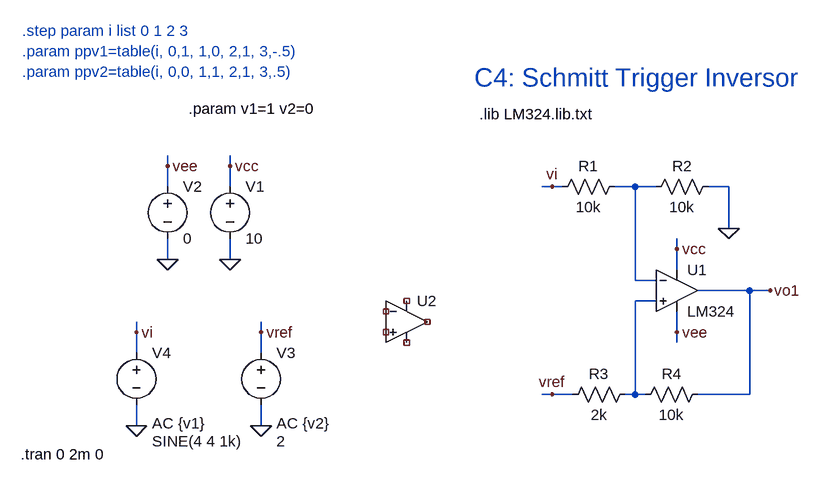
[diagram p0: schematic c4SchmittTriggerInv.asc]
c4SchmittTriggerInv.asc, the LTspice schematic file:
Version 4
SHEET 1 3476 680
WIRE -416 -224 -416 -240
WIRE -320 -224 -320 -240
WIRE -416 -192 -416 -224
WIRE -320 -192 -320 -224
WIRE 176 -192 160 -192
WIRE 192 -192 176 -192
WIRE 304 -192 272 -192
WIRE 336 -192 304 -192
WIRE 448 -192 416 -192
WIRE 448 -128 448 -192
WIRE 368 -96 368 -112
WIRE -416 -80 -416 -112
WIRE -320 -80 -320 -112
WIRE 368 -64 368 -96
WIRE 304 -48 304 -192
WIRE 336 -48 304 -48
WIRE 480 -32 400 -32
WIRE 512 -32 480 -32
WIRE 336 -16 304 -16
WIRE -464 32 -464 16
WIRE -272 32 -272 16
WIRE 368 32 368 0
WIRE 368 48 368 32
WIRE -464 64 -464 32
WIRE -272 64 -272 32
WIRE 176 128 160 128
WIRE 208 128 176 128
WIRE 304 128 304 -16
WIRE 304 128 288 128
WIRE 320 128 304 128
WIRE 480 128 480 -32
WIRE 480 128 400 128
WIRE -464 176 -464 144
WIRE -272 176 -272 144
FLAG -320 -80 0
FLAG -320 -224 vcc
FLAG -416 -80 0
FLAG -416 -224 vee
FLAG -272 176 0
FLAG -272 32 vref
FLAG -464 176 0
FLAG -464 32 vi
FLAG 368 32 vee
FLAG 368 -96 vcc
FLAG 512 -32 vo1
FLAG 176 128 vref
FLAG 448 -128 0
FLAG 176 -192 vi
SYMBOL voltage -320 -208 R0
WINDOW 123 0 0 Left 0
WINDOW 39 0 0 Left 0
SYMATTR InstName V1
SYMATTR Value 10
SYMBOL voltage -416 -208 R0
WINDOW 123 0 0 Left 0
WINDOW 39 0 0 Left 0
SYMATTR InstName V2
SYMATTR Value 0
SYMBOL voltage -272 48 R0
WINDOW 123 24 124 Left 2
WINDOW 39 0 0 Left 0
WINDOW 3 24 152 Left 2
SYMATTR Value2 AC {v2}
SYMATTR Value 2
SYMATTR InstName V3
SYMBOL voltage -464 48 R0
WINDOW 123 24 124 Left 2
WINDOW 39 0 0 Left 0
WINDOW 3 24 152 Left 2
SYMATTR Value2 AC {v1}
SYMATTR Value SINE(4 4 1k)
SYMATTR InstName V4
SYMBOL OpAmps\\opamp2 368 -96 R0
SYMATTR InstName U1
SYMATTR Value LM324
SYMBOL res 288 -208 R90
WINDOW 0 0 56 VBottom 2
WINDOW 3 32 56 VTop 2
SYMATTR InstName R1
SYMATTR Value 10k
SYMBOL res 432 -208 R90
WINDOW 0 0 56 VBottom 2
WINDOW 3 32 56 VTop 2
SYMATTR InstName R2
SYMATTR Value 10k
SYMBOL res 304 112 R90
WINDOW 0 0 56 VBottom 2
WINDOW 3 32 56 VTop 2
SYMATTR InstName R3
SYMATTR Value 2k
SYMBOL res 416 112 R90
WINDOW 0 0 56 VBottom 2
WINDOW 3 32 56 VTop 2
SYMATTR InstName R4
SYMATTR Value 10k
SYMBOL OpAmps\\UniversalOpamp2 -48 16 R0
SYMATTR InstName U2
TEXT -384 -312 Left 2 !.param v1=1 v2=0
TEXT -640 -432 Left 2 ;.step param i list 0 1 2 3\n.param ppv1=table(i, 0,1, 1,0, 2,1, 3,-.5)\n.param ppv2=table(i, 0,0, 1,1, 2,1, 3,.5)
TEXT 64 -304 Left 2 !.lib LM324.lib.txt
TEXT 56 -360 Left 4 ;C4: Schmitt Trigger Inversor
TEXT -642 220 Left 2 !.tran 0 2m 0

The netlist it stands for:
* c4SchmittTriggerInv.asc
V1 vcc 0 10
V2 vee 0 0
V3 vref 0 2 AC {v2}
V4 vi 0 SINE(4 4 1k) AC {v1}
XU1 N002 N001 vcc vee vo1 LM324  ; pins In+ In- V+ V- OUT
R1 N001 vi 10k
R2 0 N001 10k
R3 N002 vref 2k
R4 vo1 N002 10k
XU2 NC_01 NC_02 NC_03 NC_04 NC_05 level.2 Avol=1Meg GBW=10Meg Slew=10Meg ilimit=25m rail=0 Vos=0 phimargin=45 en=0 enk=0 in=0 ink=0 Rin=500Meg  ; pins IN+ IN- V+ V- OUT
.param v1=1 v2=0
* .step param i list 0 1 2 3
* .param ppv1=table(i, 0,1, 1,0, 2,1, 3,-.5)
* .param ppv2=table(i, 0,0, 1,1, 2,1, 3,.5)
.lib LM324.lib.txt
* C4: Schmitt Trigger Inversor
.tran 0 2m 0
.lib UniversalOpamps2.sub
.backanno
.end